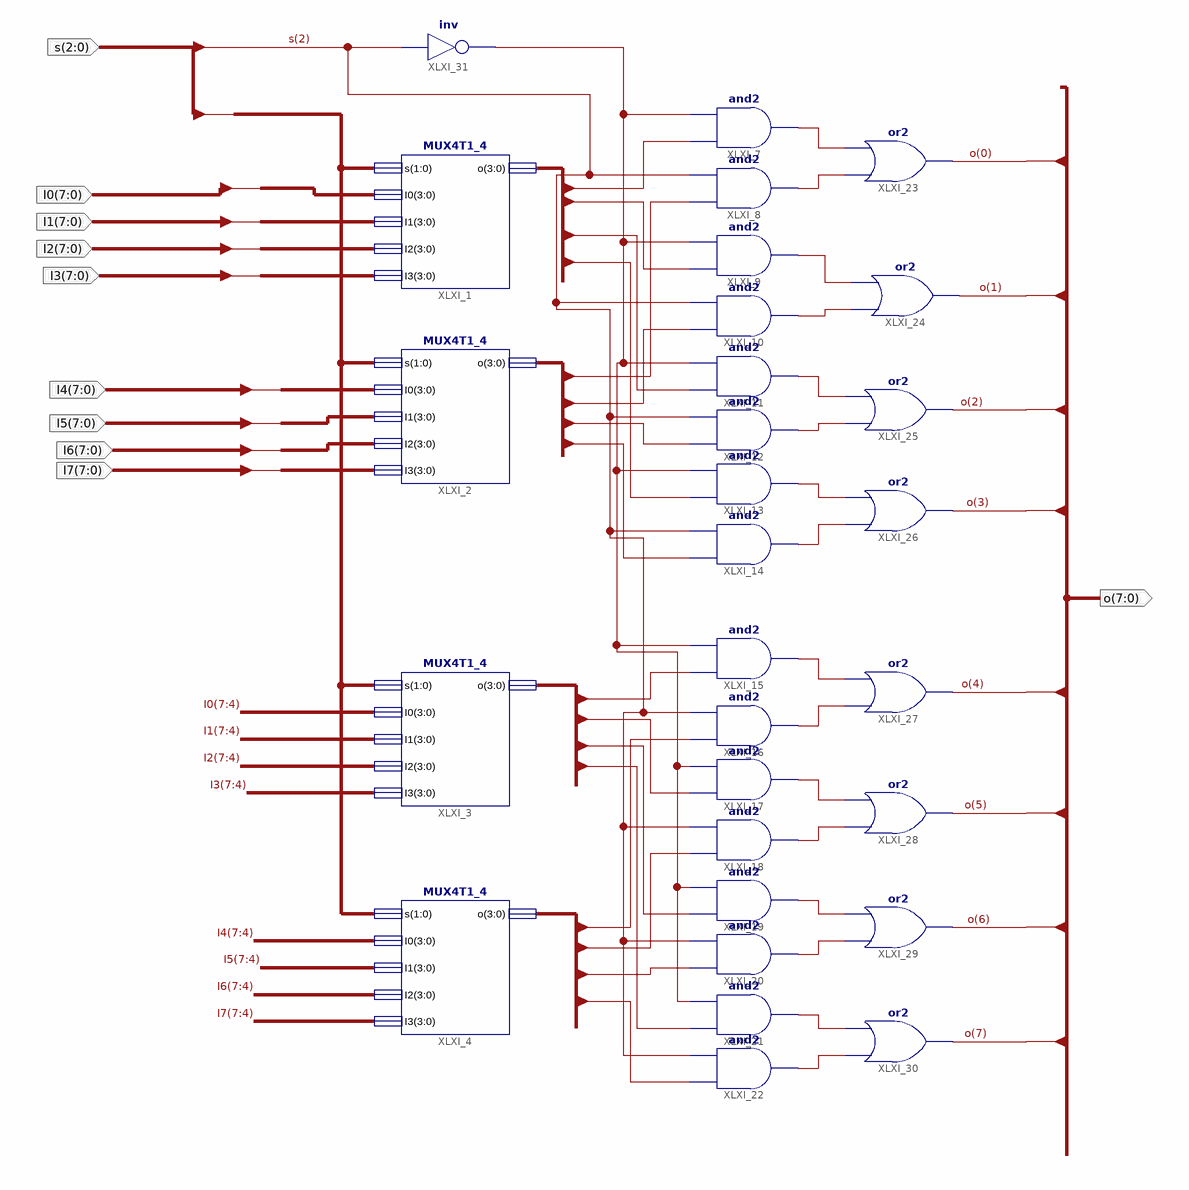
[diagram p0: schematic sheet 1]
// Xilinx ISE schematic MUX8T1_8.sch (kintex7) as structural Verilog: 29 symbols, 10 ports
module MUX8T1_8 (
  input  [7:0] I0,
  input  [7:0] I1,
  input  [7:0] I2,
  input  [7:0] I3,
  input  [7:0] I4,
  input  [7:0] I5,
  input  [7:0] I6,
  input  [7:0] I7,
  input  [2:0] s,
  output [7:0] o
);

  wire XLXN_42, XLXN_43, XLXN_44, XLXN_45, XLXN_46, XLXN_47, XLXN_48, XLXN_49, XLXN_50, XLXN_51, XLXN_52,
       XLXN_53, XLXN_54, XLXN_55, XLXN_56, XLXN_57, XLXN_76;
  wire [3:0] o0, o1, o2, o3;

  MUX4T1_4 XLXI_1 (.s(s[1:0]), .I0(I0[3:0]), .I1(I1[3:0]), .I2(I2[3:0]), .I3(I3[3:0]), .o(o0));
  MUX4T1_4 XLXI_2 (.s(s[1:0]), .I0(I4[3:0]), .I1(I5[3:0]), .I2(I6[3:0]), .I3(I7[3:0]), .o(o1));
  MUX4T1_4 XLXI_3 (.s(s[1:0]), .I0(I0[7:4]), .I1(I1[7:4]), .I2(I2[7:4]), .I3(I3[7:4]), .o(o2));
  MUX4T1_4 XLXI_4 (.s(s[1:0]), .I0(I4[7:4]), .I1(I5[7:4]), .I2(I6[7:4]), .I3(I7[7:4]), .o(o3));
  and XLXI_7 (XLXN_42, o0[0], XLXN_76);
  and XLXI_8 (XLXN_43, o1[0], s[2]);
  and XLXI_9 (XLXN_44, o0[1], XLXN_76);
  and XLXI_10 (XLXN_45, o1[1], s[2]);
  and XLXI_11 (XLXN_46, o0[2], XLXN_76);
  and XLXI_12 (XLXN_47, o1[2], s[2]);
  and XLXI_13 (XLXN_48, o0[3], XLXN_76);
  and XLXI_14 (XLXN_49, o1[3], s[2]);
  and XLXI_15 (XLXN_50, o2[0], XLXN_76);
  and XLXI_16 (XLXN_51, o3[0], s[2]);
  and XLXI_17 (XLXN_52, o2[1], XLXN_76);
  and XLXI_18 (XLXN_53, o3[1], s[2]);
  and XLXI_19 (XLXN_54, o2[2], XLXN_76);
  and XLXI_20 (XLXN_55, o3[2], s[2]);
  and XLXI_21 (XLXN_56, o2[3], XLXN_76);
  and XLXI_22 (XLXN_57, o3[3], s[2]);
  or XLXI_23 (o[0], XLXN_43, XLXN_42);
  or XLXI_24 (o[1], XLXN_45, XLXN_44);
  or XLXI_25 (o[2], XLXN_47, XLXN_46);
  or XLXI_26 (o[3], XLXN_49, XLXN_48);
  or XLXI_27 (o[4], XLXN_51, XLXN_50);
  or XLXI_28 (o[5], XLXN_53, XLXN_52);
  or XLXI_29 (o[6], XLXN_55, XLXN_54);
  or XLXI_30 (o[7], XLXN_57, XLXN_56);
  not XLXI_31 (XLXN_76, s[2]);
endmodule
